# EAGLE design Zobo (EAGLE 7.1.0)

## Sheet 1 of 2
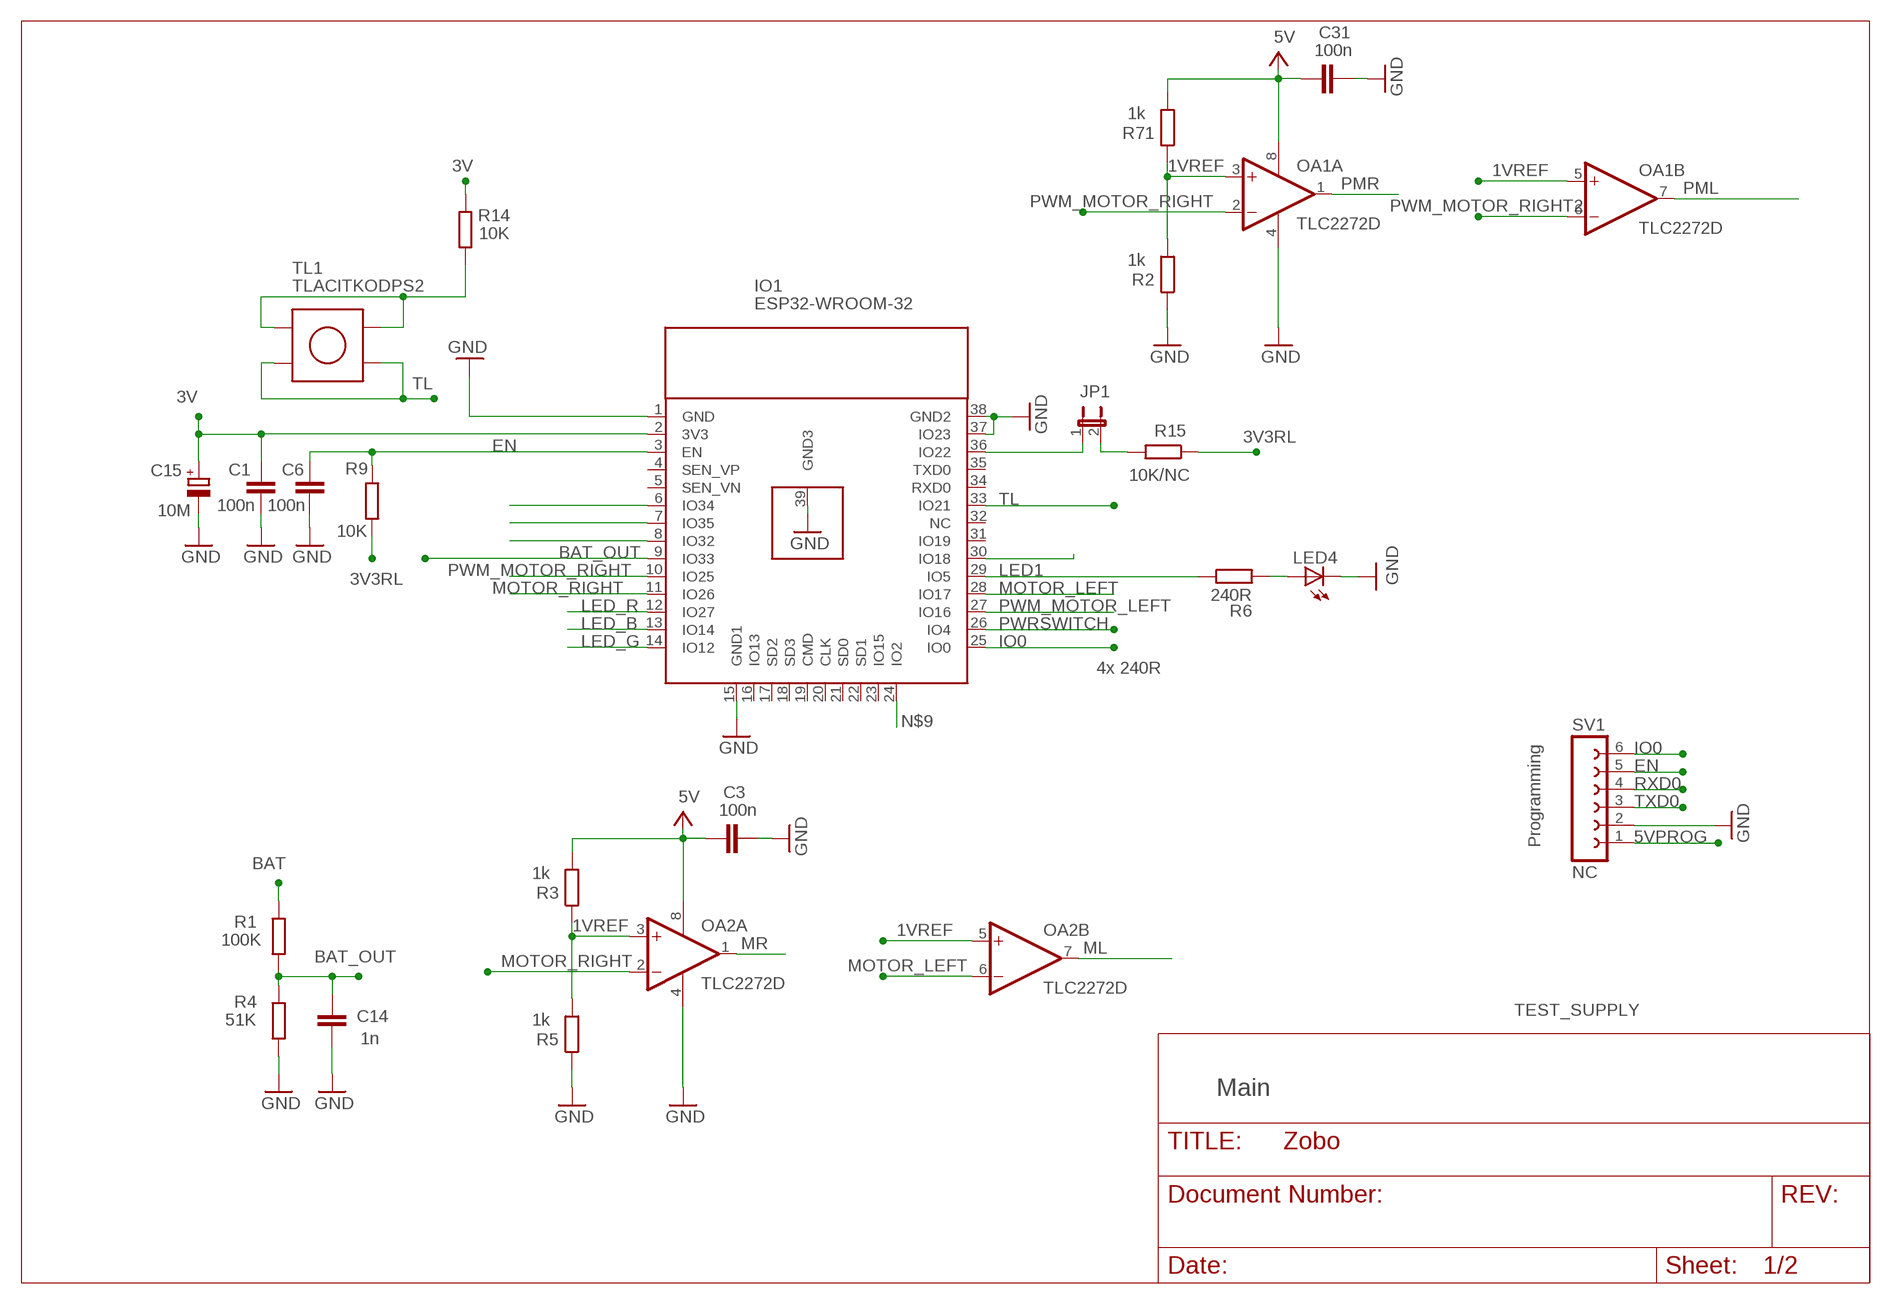
[diagram p0: schematic, sheet 1]

### Parts
C1  100n  C-EUC0805  [C0805]
C3  100n  C-EUC0805  [C0805]
C6  100n  C-EUC0805  [C0805]
C14  1n  C-EUC0805  [C0805]
C15  10M  CPOL-EUCT3216  [CT3216]
C31  100n  C-EUC0805  [C0805]
IO1  ESP32-WROOM-32  [ESP32-WROOM-32]
JP1  JP1E  [JP1]
LED4  LEDCHIPLED_0805  [CHIPLED_0805]
OA1  TLC2272D  [SO08]
OA2  TLC2272D  [SO08]
R1  100K  R-EU_R0805  [R0805]
R2  1k  R-EU_R0805  [R0805]
R3  1k  R-EU_R0805  [R0805]
R4  51K  R-EU_R0805  [R0805]
R5  1k  R-EU_R0805  [R0805]
R6  240R  R-EU_R0805  [R0805]
R9  10K  R-EU_R0805  [R0805]
R14  10K  R-EU_R0805  [R0805]
R15  10K/NC  R-EU_R0805  [R0805]
R71  1k  R-EU_R0805  [R0805]
SV1  NC  FE06-1R  [FE06]
TL1  TLACITKODPS2  [TLACITKO_DPS2]

### Nets
1VREF: OA1.3(A:+IN) OA1.5(B:+IN) OA2.3(A:+IN) OA2.5(B:+IN) R2.2 R3.1 R5.2 R71.1
3V: C1.2 C15.+ IO1.2(3V3) R14.2 ; also sheet 2
3V3RL: R9.2 R15.1
5V: C3.1 C31.1 OA1.8(A:V+) OA2.8(A:V+) R3.2 R71.2 ; also sheet 2
5VPROG: SV1.1
BAT: R1.1 ; also sheet 2
BAT_OUT: C14.2 IO1.9(IO33) R1.2 R4.1
EN: C6.2 IO1.3(EN) R9.1 SV1.5
GND: C1.1 C3.2 C6.1 C14.1 C15.- C31.2 IO1.1(GND) IO1.15(GND1) IO1.37(IO23) IO1.38(GND2) IO1.39(GND3) LED4.C OA1.4(A:V-) OA2.4(A:V-) R2.1 R4.2 R5.1 SV1.2 ; also sheet 2
IO0: IO1.25(IO0) SV1.6
LED1: IO1.29(IO5) R6.1
LED_B: IO1.13(IO14)
LED_G: IO1.14(IO12)
LED_R: IO1.12(IO27)
ML: OA2.7(B:OUT)
MOTOR_LEFT: IO1.28(IO17) OA2.6(B:-IN)
MOTOR_RIGHT: IO1.11(IO26) OA2.2(A:-IN)
MR: OA2.1(A:OUT)
N$1: IO1.30(IO18)
N$2: IO1.8(IO32)
N$5: IO1.36(IO22) JP1.1
N$7: JP1.2 R15.2
N$8: R14.1 TL1.1 TL1.2
N$9: IO1.24(IO2)
N$13: IO1.6(IO34)
N$14: IO1.7(IO35)
N$25: LED4.A R6.2
PML: OA1.7(B:OUT)
PMR: OA1.1(A:OUT)
PWM_MOTOR_LEFT: IO1.27(IO16)
PWM_MOTOR_RIGHT: IO1.10(IO25) OA1.2(A:-IN)
PWM_MOTOR_RIGHT2: OA1.6(B:-IN)
PWRSWITCH: IO1.26(IO4)
RXD0: SV1.4
TL: IO1.33(IO21) TL1.3 TL1.4
TXD0: SV1.3
Unconnected: IO1.4(SEN_VP) IO1.5(SEN_VN) IO1.16(IO13) IO1.17(SD2) IO1.18(SD3) IO1.19(CMD) IO1.20(CLK) IO1.21(SD0) IO1.22(SD1) IO1.23(IO15) IO1.31(IO19) IO1.32(NC) IO1.34(RXD0) IO1.35(TXD0)

### Notes on the sheet
- 4x 240R
- Programming
- TEST_SUPPLY
- Main

## Sheet 2 of 2
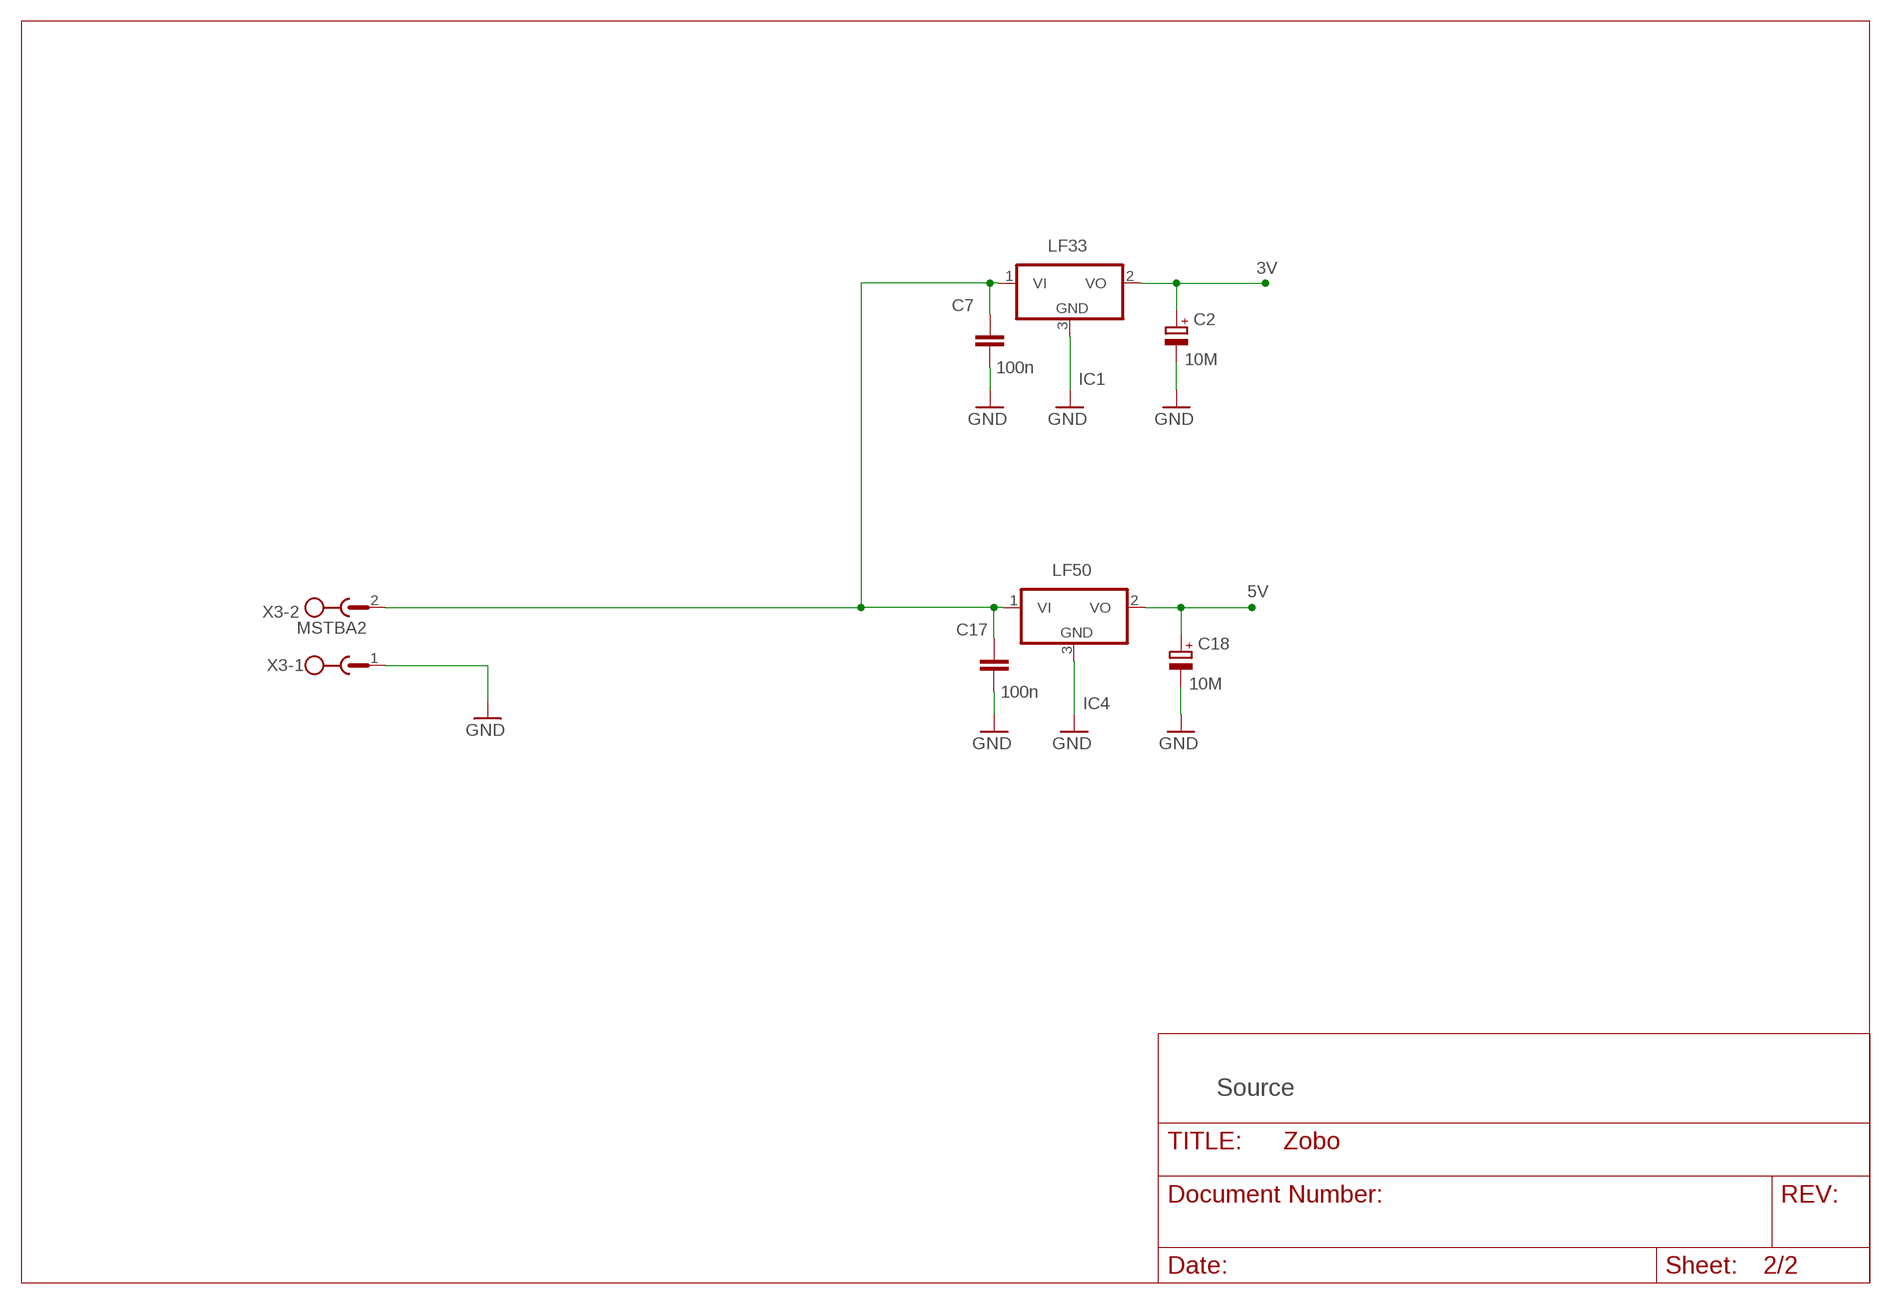
[diagram p1: schematic, sheet 2]

### Parts
C2  10M  CPOL-EUCT3216  [CT3216]
C7  100n  C-EUC0805  [C0805]
C17  100n  C-EUC0805  [C0805]
C18  10M  CPOL-EUCT3216  [CT3216]
IC1  LF33  7805DT  [TO252]
IC4  LF50  7805DT  [TO252]
X3  MSTBA2  [MSTBA2]

### Nets
3V: C2.+ IC1.2(VO) ; also sheet 1
5V: C18.+ IC4.2(VO) ; also sheet 1
BAT: C7.2 C17.2 IC1.1(VI) IC4.1(VI) X3.2 ; also sheet 1
GND: C2.- C7.1 C17.1 C18.- IC1.3(GND) IC4.3(GND) X3.1 ; also sheet 1

### Notes on the sheet
- Source

## Library data of the parts
C1 C6 C7 C14 C17 = rcl:C-EU: CAPACITOR, European symbol
C2 C15 C18 = rcl:CPOL-EU: POLARIZED CAPACITOR, European symbol
C3 C31 = rcl_TOM:C-EU: CAPACITOR, European symbol
IC1 IC4 = linear:78*: Positive VOLTAGE REGULATOR Source: http://cache.national.com/ds/LM/LM78L05.pdf http://www.fairchildsemi.com/ds/LM/LM7805.pdf
IO1 = Petrov 30.1.2019:ESP32-WROOM-32
JP1 = jumper:JP1E: JUMPER
LED4 = led:LED: LED OSRAM: - CHIPLED LG R971, LG N971, LY N971, LG Q971, LY Q971, LO R971, LY R971 LH N974, LH R974 LS Q976, LO Q976, LY Q976 LO Q996 - Hyper CHIPLED LW Q18S LB Q993, LB Q99A, LB R99A - SideLED LS A670, LO A670, LY A670, LG A670, LP A670 LB A673, LV A673, LT A673, LW A673 LH A674 LY A675 LS A676, LA A676, LO A676, LY A676, LW A676 LS A679, LY A679, LG A679 - Hyper Micro SIDELED® LS Y876, LA Y876, LO Y876, LY Y876 LT Y87S - SmartLED LW L88C, LW L88S LB L89C, LB L89S, LG L890 LS L89K, LO L89K, LY L89K LS L896, LA L896, LO L896, LY L896 - TOPLED LS T670, LO T670, LY T670, LG T670, LP T670 LSG T670, LSP T670, LSY T670, LOP T670, LYG T670 LG T671, LOG T671, LSG T671 LB T673, LV T673, LT T673, LW T673 LH T674 LS T676, LA T676, LO T676, LY T676, LB T676, LH T676, LSB T676, LW T676 LB T67C, LV T67C, LT T67C, LS T67K, LO T67K, LY T67K, LW E67C LS E67B, LA E67B, LO E67B, LY E67B, LB E67C, LV E67C, LT E67C LW T67C LS T679, LY T679, LG T679 LS T770, LO T770, LY T770, LG T770, LP T770 LB T773, LV T773, LT T773, LW T773 LH T774 LS E675, LA E675, LY E675, LS T675 LS T776, LA T776, LO T776, LY T776, LB T776 LHGB T686 LT T68C, LB T68C - Hyper Mini TOPLED® LB M676 - Mini TOPLED Santana® LG M470 LS M47K, LO M47K, LY M47K Source: http://www.osram.convergy.de LUXEON: - LUMILED® LXK2-PW12-R00, LXK2-PW12-S00, LXK2-PW14-U00, LXK2-PW14-V00 LXK2-PM12-R00, LXK2-PM12-S00, LXK2-PM14-U00 LXK2-PE12-Q00, LXK2-PE12-R00, LXK2-PE12-S00, LXK2-PE14-T00, LXK2-PE14-U00 LXK2-PB12-K00, LXK2-PB12-L00, LXK2-PB12-M00, LXK2-PB14-N00, LXK2-PB14-P00, LXK2-PB14-Q00 LXK2-PR12-L00, LXK2-PR12-M00, LXK2-PR14-Q00, LXK2-PR14-R00 LXK2-PD12-Q00, LXK2-PD12-R00, LXK2-PD12-S00 LXK2-PH12-R00, LXK2-PH12-S00 LXK2-PL12-P00, LXK2-PL12-Q00, LXK2-PL12-R00 Source: www.luxeon.com KINGBRIGHT: KA-3528ASYC Source: www.kingbright.com
OA1 OA2 = linear_TOM:TLC2272: Advanced LinCMOS RAIL-TO-RAIL Operational Amplifier
R1-R6 R9 R14 R15 R71 = rcl:R-EU_: RESISTOR, European symbol
SV1 = con-lsta_TOM:FE06-1: FEMALE HEADER
TL1 = Petrov 22.7.2020:TLACITKO?DPS2
X3 = con-phoenix-508:MSTBA2: PHOENIX; MF: FARNELL; MPN: 1757242; OC_FARNELL: 3705171; OC_NEWARK: 71C4161

## Board
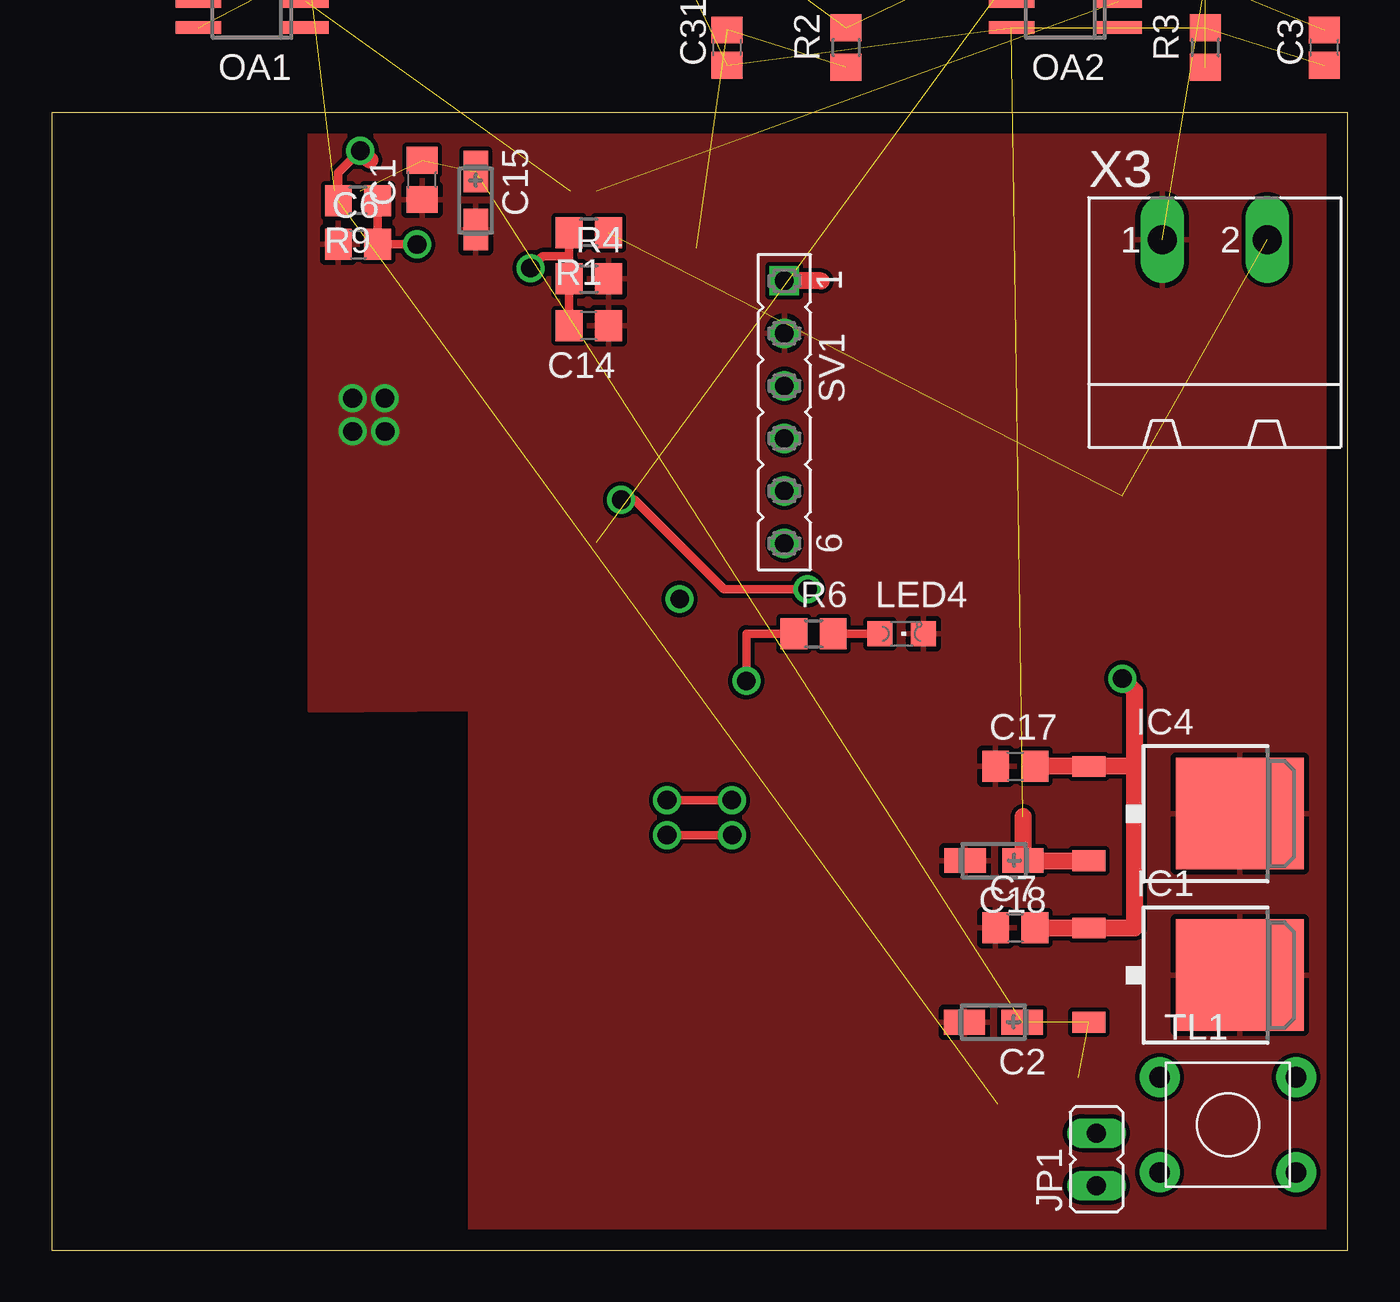
[diagram p2: board, top side]
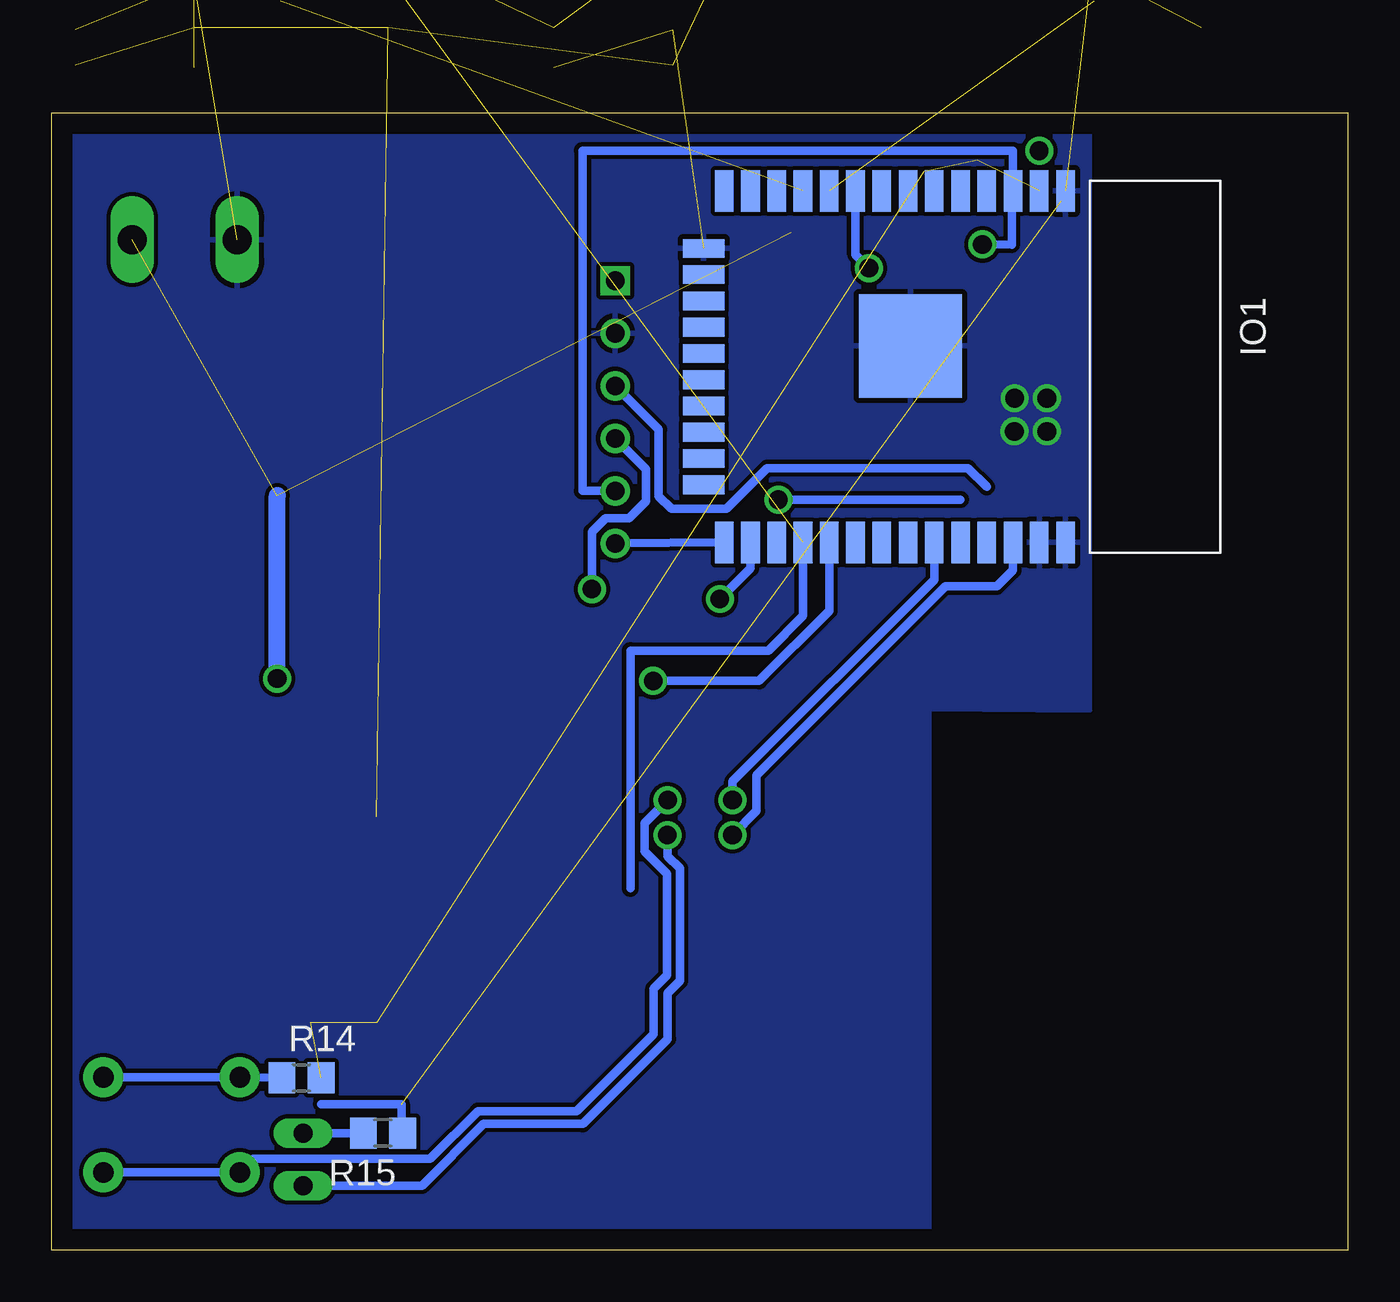
[diagram p3: board, bottom side, seen from below]

Size 62.71 x 55 mm. Coordinates in mm from the lower left corner, seen from the top.
Outline: 0,55 0,0 62.71,0 62.71,55 0,55
Copper layers (1*16): Top 0.035mm / dielectric 1.5mm / Bottom 0.035mm
Design rules "default": minimum track width 10mil, minimum drill 24mil, track to track 8mil, track to pad 8mil, pad to pad 8mil, via to via 8mil, smd to smd 8mil, copper to edge 40mil, drill to drill 8mil, minimum pad ring 10mil, minimum via ring 8mil, stop-mask expansion 4mil, vias tented up to drill 0mil, thermal gap 10mil

### Footprints (pad centres in the part's own frame; a part is rotated, then mirrored left to right if it is on the bottom)
C0805 = smd 1.3 x 1.5: 1 -0.95,0; 2 0.95,0
CT3216 = smd 2 x 1.2: + -1.4,0; - 1.4,0
C0805' = smd 1.3 x 1.5: 1 -0.85,0; 2 0.85,0
TO252 = smd 1 x 1.6: 1 -2.28,-4.8; 2 2.28,-4.8 | smd 5.4 x 6.2: 3 0,2.5
ESP32-WROOM-32 = smd 2 x 0.9: 1 0,0; 2 0,-1.27; 3 0,-2.54; 4 0,-3.81; 5 0,-5.08; 6 0,-6.35; 7 0,-7.62; 8 0,-8.89; 9 0,-10.16; 10 0,-11.43; 11 0,-12.7; 12 0,-13.97; 13 0,-15.24; 14 0,-16.51; 25 17,-16.51; 26 17,-15.24; 27 17,-13.97; 28 17,-12.7; 29 17,-11.43; 30 17,-10.16; 31 17,-8.89; 32 17,-7.62; 33 17,-6.35; 34 17,-5.08; 35 17,-3.81; 36 17,-2.54; 37 17,-1.27; 38 17,0 | smd 0.9 x 2: 15 2.785,-17.51; 16 4.055,-17.51; 17 5.325,-17.51; 18 6.595,-17.51; 19 7.865,-17.51; 20 9.135,-17.51; 21 10.405,-17.51; 22 11.675,-17.51; 23 12.945,-17.51; 24 14.215,-17.51 | smd 5 x 5: 39 7.5,-7.5
JP1 = drill 0.914 long: 1 0,-1.27; 2 0,1.27
CHIPLED_0805 = smd 1.2 x 1.2: A 0,-1.05; C 0,1.05
SO08 = smd 0.6 x 2.2: 1 -1.905,-2.6; 2 -0.635,-2.6; 3 0.635,-2.6; 4 1.905,-2.6; 5 1.905,2.6; 6 0.635,2.6; 7 -0.635,2.6; 8 -1.905,2.6
R0805 = smd 1.3 x 1.5: 1 -0.95,0; 2 0.95,0
FE06 = drill 0.9 pad 1.422 square: 1 -6.35,0 | drill 0.9 pad 1.422: 2 -3.81,0; 3 -1.27,0; 4 1.27,0; 5 3.81,0; 6 6.35,0
TLACITKO_DPS2 = drill 1 pad 1.93: 1 -3.3,2.3; 2 3.3,2.3; 3 -3.3,-2.3; 4 3.3,-2.3
MSTBA2 = drill 1.397 long: 1 -2.54,5.08; 2 2.54,5.08

### Placement (x,y rotation side)
C1  17.92,51.76 90 top
C2  45.56,11.02 180 top
C3  100n  [C0805']  61.57,58.16 90 top
C6  14.82,48.64 0 top
C7  46.62,15.59 0 top
C14  25.99,44.71 180 top
C15  20.52,50.76 270 top
C17  46.62,23.4 0 top
C18  45.59,18.84 180 top
C31  100n  [C0805']  32.68,58.16 90 top
IC1  54.99,13.3 270 top
IC4  54.99,21.11 270 top
IO1  13.66,51.23 270 bottom
JP1  50.55,4.39 0 top
LED4  41.12,29.81 270 top
OA1  9.69,61.03 90 top  (outside the outline)
OA2  49.04,61.03 90 top  (outside the outline)
R1  25.99,49.21 180 top
R2  38.44,58.16 90 top
R3  55.81,58.16 90 top
R4  25.99,46.97 0 top
R5  55.81,62.33 90 top  (outside the outline)
R6  36.86,29.81 0 top
R9  14.82,50.76 180 top
R14  50.62,8.34 0 bottom
R15  46.68,5.66 180 bottom
R71  26.92,68.54 90 top  (outside the outline)
SV1  35.45,40.53 270 top
TL1  56.91,6.06 0 top
X3  56.27,43.79 0 top

### Tracks (layer width: path | path; a pad name or v marks a point on that pad's centre or on a via)
1VREF  (7 unrouted)
3V  (5 unrouted)
3V3RL  (via drill 0.9)  (1 unrouted)
  Top 0.406: R9.2 13.87,52.11 v14.93,53.17
  Top 0.813: 15.39,52.71 v14.93,53.17
  Bottom 0.406: 49.67,7.06 45.78,7.06 45.78,5.67 R15.1
5V  (6 unrouted)
  Top 0.813: IC4.2 C18.+ 46.99,20.96
5VPROG
  Top 0.813: 37.24,46.88 SV1.1
BAT  (via drill 0.9)  (2 unrouted)
  Top 0.813: C7.2 IC1.1 52.4,15.58 52.4,23.4 | 52.4,23.4 IC4.1 C17.2 | 52.4,23.4 52.4,27.04 v51.8,27.64
  Bottom 0.813: v51.8,27.64 51.8,36.49
BAT_OUT  (via drill 0.9)
  Top 0.406: 25.04,47.94 R4.1 C14.2 | 25.04,47.94 R1.2 24.81,48.98 | 25.04,47.94 24.92,48.06 23.74,48.06 v23.17,47.49
  Bottom 0.406: IO1.9 23.82,48.14 v23.17,47.49
EN  (via drill 0.9)
  Top 0.406: R9.1 C6.2 v17.68,48.64
  Bottom 0.406: SV1.5 37.03,36.72 37.03,53.18 16.2,53.18 IO1.3 16.26,51.17 16.26,48.63 v17.68,48.64
GND  (via drill 0.9)  (6 unrouted)
  other vias: 14.56,41.2 16.12,41.2 14.56,39.6 16.13,39.6
  pour Bottom: 12.5,55 62.71,55 62.71,0 20.26,0.05 20.26,26.17 12.5,26.12
  pour Top: 12.5,55 62.71,55 62.71,0 20.26,0.05 20.26,26.17 12.5,26.12
IO0
  Bottom 0.406: IO1.25 SV1.6
LED1  (via drill 0.9)
  Top 0.406: R6.1 33.61,29.81 v33.61,27.53
  Bottom 0.406: IO1.29 25.09,30.92 28.48,27.53 v33.61,27.53
MOTOR_LEFT  (1 unrouted)
  Bottom 0.406: IO1.28 26.36,30.67 28.04,28.99 34.71,28.99 34.71,17.49
MOTOR_RIGHT  (1 unrouted)
N$5  (via drill 0.9)
  Top 0.406: v32.92,20.07 v29.77,20.07
  Bottom 0.406: IO1.36 16.2,32.88 16.98,32.1 19.46,32.1 28.6,22.96 28.6,21.24 v29.77,20.07 | v32.92,20.07 32.92,19.06 32.32,18.46 32.32,13.02 32.91,12.43 32.91,10.2 37.01,6.1 41.82,6.1 44.8,3.12 JP1.1
N$7
  Bottom 0.406: R15.2 JP1.2
N$8
  Bottom 0.406: R14.1 TL1.1 TL1.2
N$25
  Top 0.406: R6.2 LED4.A
PWM_MOTOR_RIGHT  (1 unrouted)
PWRSWITCH  (via drill 0.9)
  Bottom 0.406: IO1.26 28.9,32.97 v30.38,31.49
RXD0  (via drill 0.9)
  Top 0.406: v27.55,36.29 28.19,36.29 32.52,31.96 v36.56,31.96 v36.57,31.97
  Bottom 0.406: SV1.4 33.96,37.77 33.96,36.21 34.77,35.4 35.92,35.4 36.57,34.75 v36.57,31.97 | 18.74,36.29 v27.55,36.29
TL  (via drill 0.9)
  Top 0.406: v32.91,21.76 v29.77,21.76
  Bottom 0.406: IO1.33 20.01,32.43 29.77,22.67 v29.77,21.76 | v32.91,21.76 34.02,20.65 34.02,19.28 32.94,18.2 32.94,13.29 33.58,12.65 33.58,10.45 37.31,6.72 42.08,6.72 44.39,4.41 52.96,4.41 TL1.3 TL1.4
TXD0
  Bottom 0.406: SV1.3 33.34,39.69 33.34,36.47 32.73,35.86 30.06,35.86 28.1,37.82 18.38,37.82 17.47,36.91

### Text on the board
tStop: + | + | BAT+R | 3V3
bStop: KLUKA_GP_02